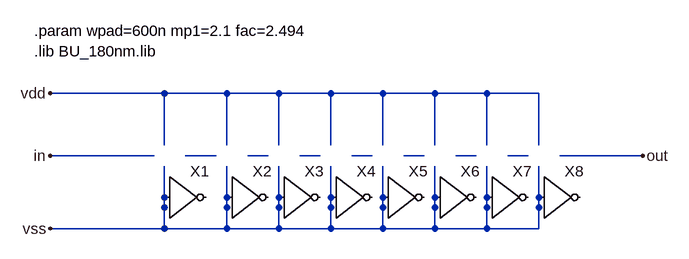
[diagram p0: schematic pad_buffer.asc]
pad_buffer.asc, the LTspice schematic file:
Version 4
SHEET 1 1168 680
WIRE 160 224 -16 224
WIRE 256 224 160 224
WIRE 336 224 256 224
WIRE 416 224 336 224
WIRE 496 224 416 224
WIRE 576 224 496 224
WIRE 656 224 576 224
WIRE 736 224 656 224
WIRE 160 304 160 224
WIRE 256 304 256 224
WIRE 336 304 336 224
WIRE 416 304 416 224
WIRE 496 304 496 224
WIRE 576 304 576 224
WIRE 656 304 656 224
WIRE 736 304 736 224
WIRE 144 320 -16 320
WIRE 240 320 192 320
WIRE 320 320 288 320
WIRE 400 320 368 320
WIRE 480 320 448 320
WIRE 560 320 528 320
WIRE 640 320 608 320
WIRE 720 320 688 320
WIRE 896 320 768 320
WIRE 160 432 160 336
WIRE 160 432 -16 432
WIRE 256 432 256 336
WIRE 256 432 160 432
WIRE 336 432 336 336
WIRE 336 432 256 432
WIRE 416 432 416 336
WIRE 416 432 336 432
WIRE 496 432 496 336
WIRE 496 432 416 432
WIRE 576 432 576 336
WIRE 576 432 496 432
WIRE 656 432 656 336
WIRE 656 432 576 432
WIRE 736 432 736 336
WIRE 736 432 656 432
FLAG -16 224 vdd
FLAG -16 320 in
FLAG 896 320 out
FLAG -16 432 vss
SYMBOL inv 160 320 R0
SYMATTR InstName X1
SYMATTR SpiceLine ll=180n wn={wpad} wp={wpad*mp1}
SYMBOL inv 256 320 R0
SYMATTR InstName X2
SYMATTR SpiceLine ll=180n wn={wpad*fac} wp={wpad*mp1*fac}
SYMBOL inv 336 320 R0
SYMATTR InstName X3
SYMATTR SpiceLine ll=180n wn={wpad*fac*fac} wp={wpad*mp1*fac*fac}
SYMBOL inv 416 320 R0
SYMATTR InstName X4
SYMATTR SpiceLine ll=180n wn={wpad*fac*fac*fac} wp={wpad*mp1*fac*fac*fac}
SYMBOL inv 496 320 R0
SYMATTR InstName X5
SYMATTR SpiceLine ll=180n wn={wpad*fac*fac*fac*fac} wp={wpad*mp1*fac*fac*fac*fac}
SYMBOL inv 576 320 R0
SYMATTR InstName X6
SYMATTR SpiceLine ll=180n wn={wpad*fac*fac*fac*fac*fac} wp={wpad*mp1*fac*fac*fac*fac*fac}
SYMBOL inv 656 320 R0
SYMATTR InstName X7
SYMATTR SpiceLine ll=180n wn={wpad*fac*fac*fac*fac*fac*fac} wp={wpad*mp1*fac*fac*fac*fac*fac*fac}
SYMBOL inv 736 320 R0
SYMATTR InstName X8
SYMATTR SpiceLine ll=180n wn={wpad*fac*fac*fac*fac*fac*fac*fac} wp={wpad*mp1*fac*fac*fac*fac*fac*fac*fac}
TEXT -40 128 Left 2 !.param wpad=600n mp1=2.1 fac=2.494\n.lib BU_180nm.lib

The netlist it stands for:
* pad_buffer.asc
A§X1 vss vss vss vss vss vss vss vss BUF ll=180n wn={wpad} wp={wpad*mp1}
A§X2 vss vss vss vss vss vss vss vss BUF ll=180n wn={wpad*fac} wp={wpad*mp1*fac}
A§X3 vss vss vss vss vss vss vss vss BUF ll=180n wn={wpad*fac*fac} wp={wpad*mp1*fac*fac}
A§X4 vss vss vss vss vss vss vss vss BUF ll=180n wn={wpad*fac*fac*fac} wp={wpad*mp1*fac*fac*fac}
A§X5 vss vss vss vss vss vss vss vss BUF ll=180n wn={wpad*fac*fac*fac*fac} wp={wpad*mp1*fac*fac*fac*fac}
A§X6 vss vss vss vss vss vss vss vss BUF ll=180n wn={wpad*fac*fac*fac*fac*fac} wp={wpad*mp1*fac*fac*fac*fac*fac}
A§X7 vss vss vss vss vss vss vss vss BUF ll=180n wn={wpad*fac*fac*fac*fac*fac*fac} wp={wpad*mp1*fac*fac*fac*fac*fac*fac}
A§X8 vss vss vss vss vss vss vss vss BUF ll=180n wn={wpad*fac*fac*fac*fac*fac*fac*fac} wp={wpad*mp1*fac*fac*fac*fac*fac*fac*fac}
.param wpad=600n mp1=2.1 fac=2.494
.lib BU_180nm.lib
.backanno
.end